# Altium schematic sheet 17 Revision History.SchDoc
size A2; VersionControl_RevNumber: DNP; IsUserConfigurable: DNP; OrgAddr3: Sunrise FL 33323; OrgName: Pixels on Target; Page Create Date: March  8, 1995; Page Number: 5; Page Size: A2; Page Count: 14; OrgAddr2: Suite #104; RevCode: A; Doc: SCH30-00070-00; DsnPath: C:\Users\Carter Nichols\Documents\BitBucket boards (Cadence)\30-00070-00_Original\SCH30-00070-00.DSN; SchematicName: SC30-00070-00; PageName: 05-POWER IN; PageSize: A2; TopSchematic: True; Address4: United States
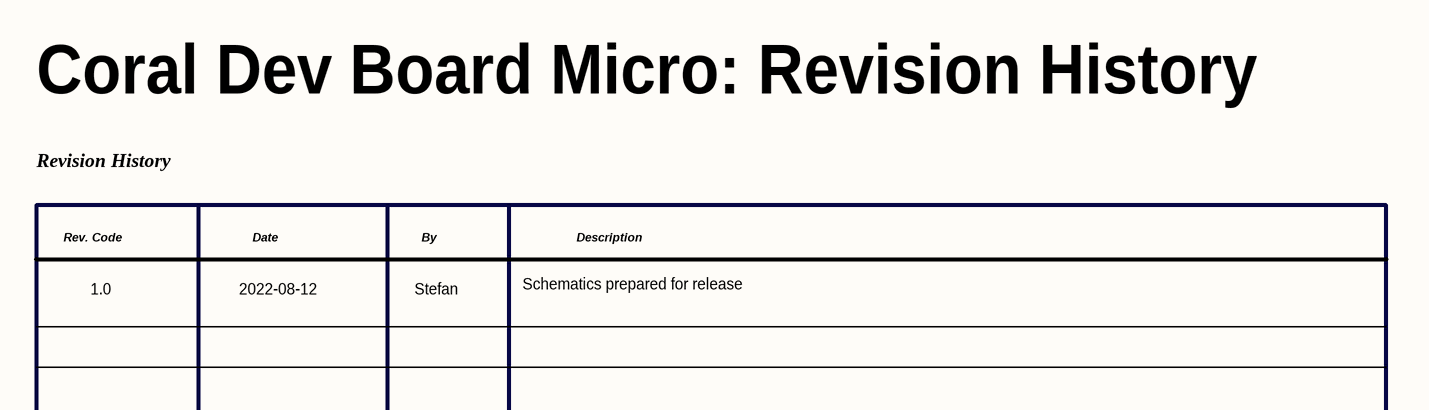
[diagram p0: 17 Revision History.SchDoc, left]
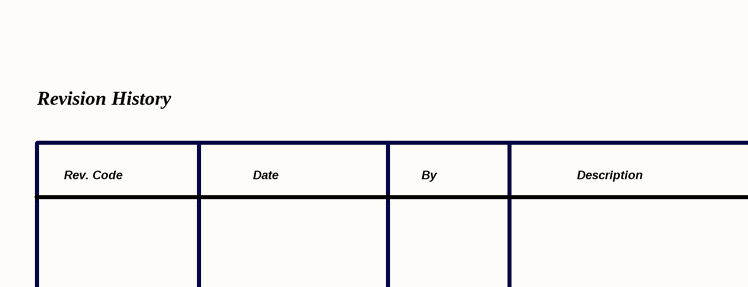
[diagram p1: 17 Revision History.SchDoc, right]

## Notes on the sheet
- Coral Dev Board Micro: Revision History
- Revision History
- Rev. Code
- Date
- By
- Description
- 1.0
- 2022-08-12
- Stefan
- Schematics prepared for release
- Title
- Size:
- Date:
- File:
- A2
- Number:
- Time:
- Revision:
- Sheet
- of